# EAGLE design shieldplank (EAGLE 6.2)
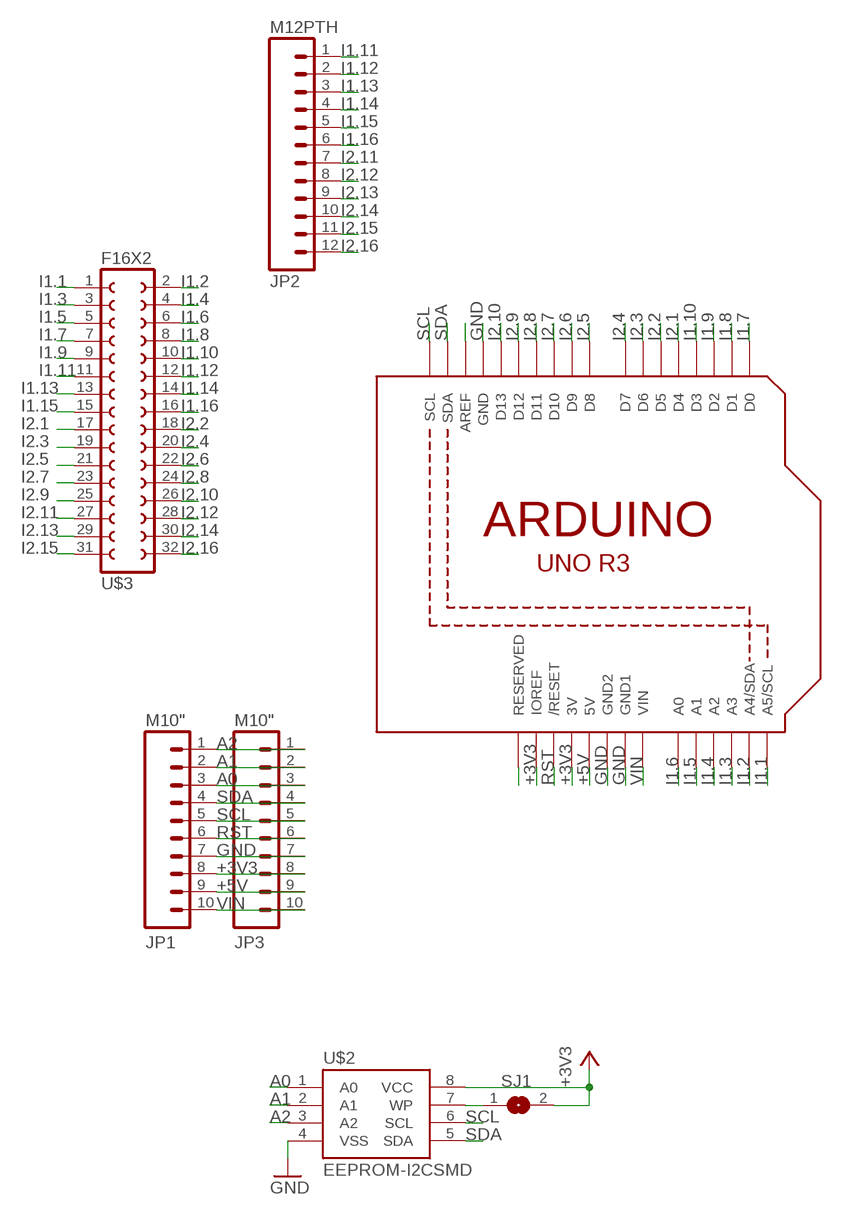
[diagram p0: schematic, sheet 1]

## Parts
JP1  M10"  [1X10]
JP2  M12PTH  [1X12]
JP3  M10"  [1X10]
SJ1  SJ  [SJ]
U1  ARDUINOR3-BPLACE  [ARDUINOR3-BPLACE]
U$2  EEPROM-I2CSMD  [SO08]
U$3  F16X2  [FE16-2]

## Nets
+3V3: JP1.8 JP3.8 SJ1.2 U1.3V U1.IOREF U$2.8(VCC)
+5V: JP1.9 JP3.9 U1.5V
A0: JP1.3 JP3.3 U$2.1(A0)
A1: JP1.2 JP3.2 U$2.2(A1)
A2: JP1.1 JP3.1 U$2.3(A2)
GND: JP1.7 JP3.7 U1.GND U1.GND1 U1.GND2 U$2.4(VSS)
I1.1: U1.A5(A5/SCL) U$3.1
I1.2: U1.A4(A4/SDA) U$3.2
I1.3: U1.A3 U$3.3
I1.4: U1.A2 U$3.4
I1.5: U1.A1 U$3.5
I1.6: U1.A0 U$3.6
I1.7: U1.D0 U$3.7
I1.8: U1.D1 U$3.8
I1.9: U1.D2 U$3.9
I1.10: U1.D3 U$3.10
I1.11: JP2.1 U$3.11
I1.12: JP2.2 U$3.12
I1.13: JP2.3 U$3.13
I1.14: JP2.4 U$3.14
I1.15: JP2.5 U$3.15
I1.16: JP2.6 U$3.16
I2.1: U1.D4 U$3.17
I2.2: U1.D5 U$3.18
I2.3: U1.D6 U$3.19
I2.4: U1.D7 U$3.20
I2.5: U1.D8 U$3.21
I2.6: U1.D9 U$3.22
I2.7: U1.D10 U$3.23
I2.8: U1.D11 U$3.24
I2.9: U1.D12 U$3.25
I2.10: U1.D13 U$3.26
I2.11: JP2.7 U$3.27
I2.12: JP2.8 U$3.28
I2.13: JP2.9 U$3.29
I2.14: JP2.10 U$3.30
I2.15: JP2.11 U$3.31
I2.16: JP2.12 U$3.32
N$1: SJ1.1 U$2.7(WP)
N$4: U1.AREF
N$20: U1.RESERVED
RST: JP1.6 JP3.6 U1.RESET(/RESET)
SCL: JP1.5 JP3.5 U1.SCL U$2.6(SCL)
SDA: JP1.4 JP3.4 U1.SDA U$2.5(SDA)
VIN: JP1.10 JP3.10 U1.VIN

## Library data of the parts
JP1 JP3 = SparkFun-Connectors:M10: Header 10 Standard 10-pin 0.1" header. Use with straight break away headers (SKU : PRT-00116), right angle break away headers (PRT-00553), swiss pins (PRT-00743), machine pins (PRT-00117), and female headers (PRT-00115).
JP2 = SparkFun-Connectors:M12: Header 12 Standard 12-pin 0.1" header. Use with straight break away headers (SKU : PRT-00116), right angle break away headers (PRT-00553), swiss pins (PRT-00743), machine pins (PRT-00117), and female headers (PRT-00115).
SJ1 = jumper:SJ: SMD solder JUMPER
U1 = adafruit:ARDUINOR3: This is a new object for the new Arduino R3 - with extra pins that you may want to use (such as IOref, and duplicated A4/A5
U$2 = SparkFun-DigitalIC:EEPROM-I2C: I2C EEPROM chips, 24LC256 (and others)
U$3 = nickparts:F16X2

## Board
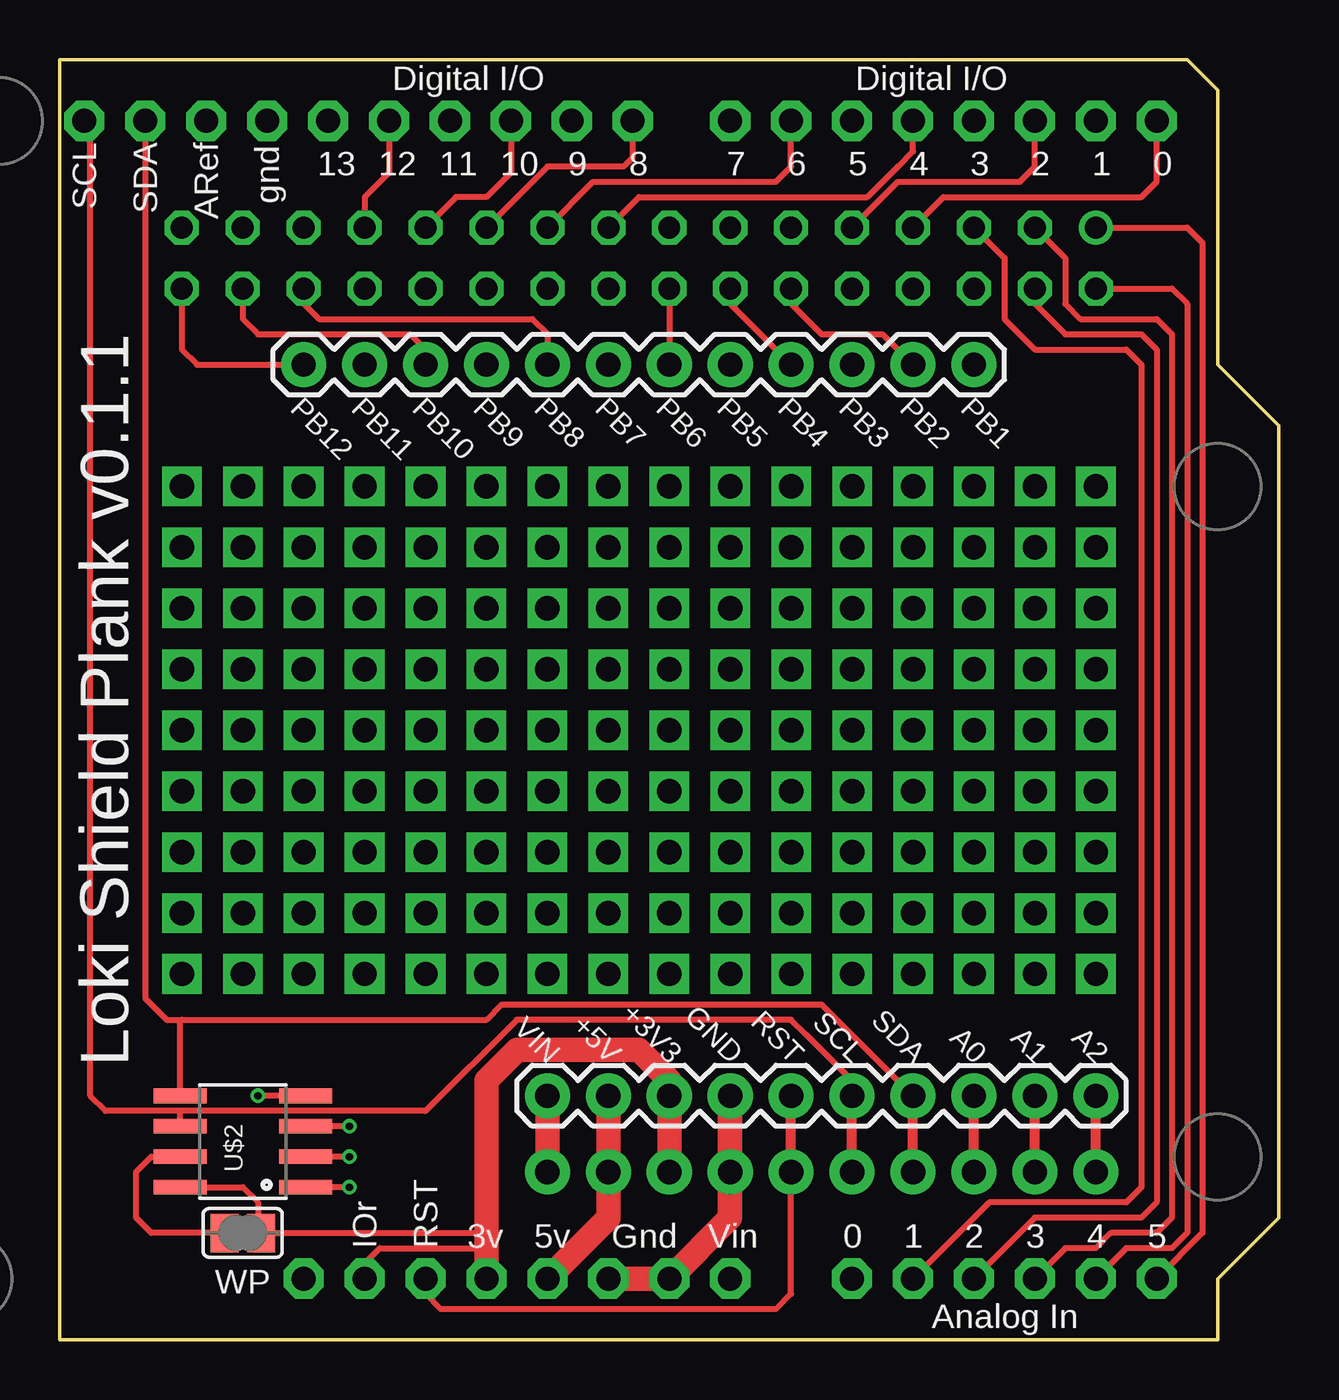
[diagram p1: board, top side]
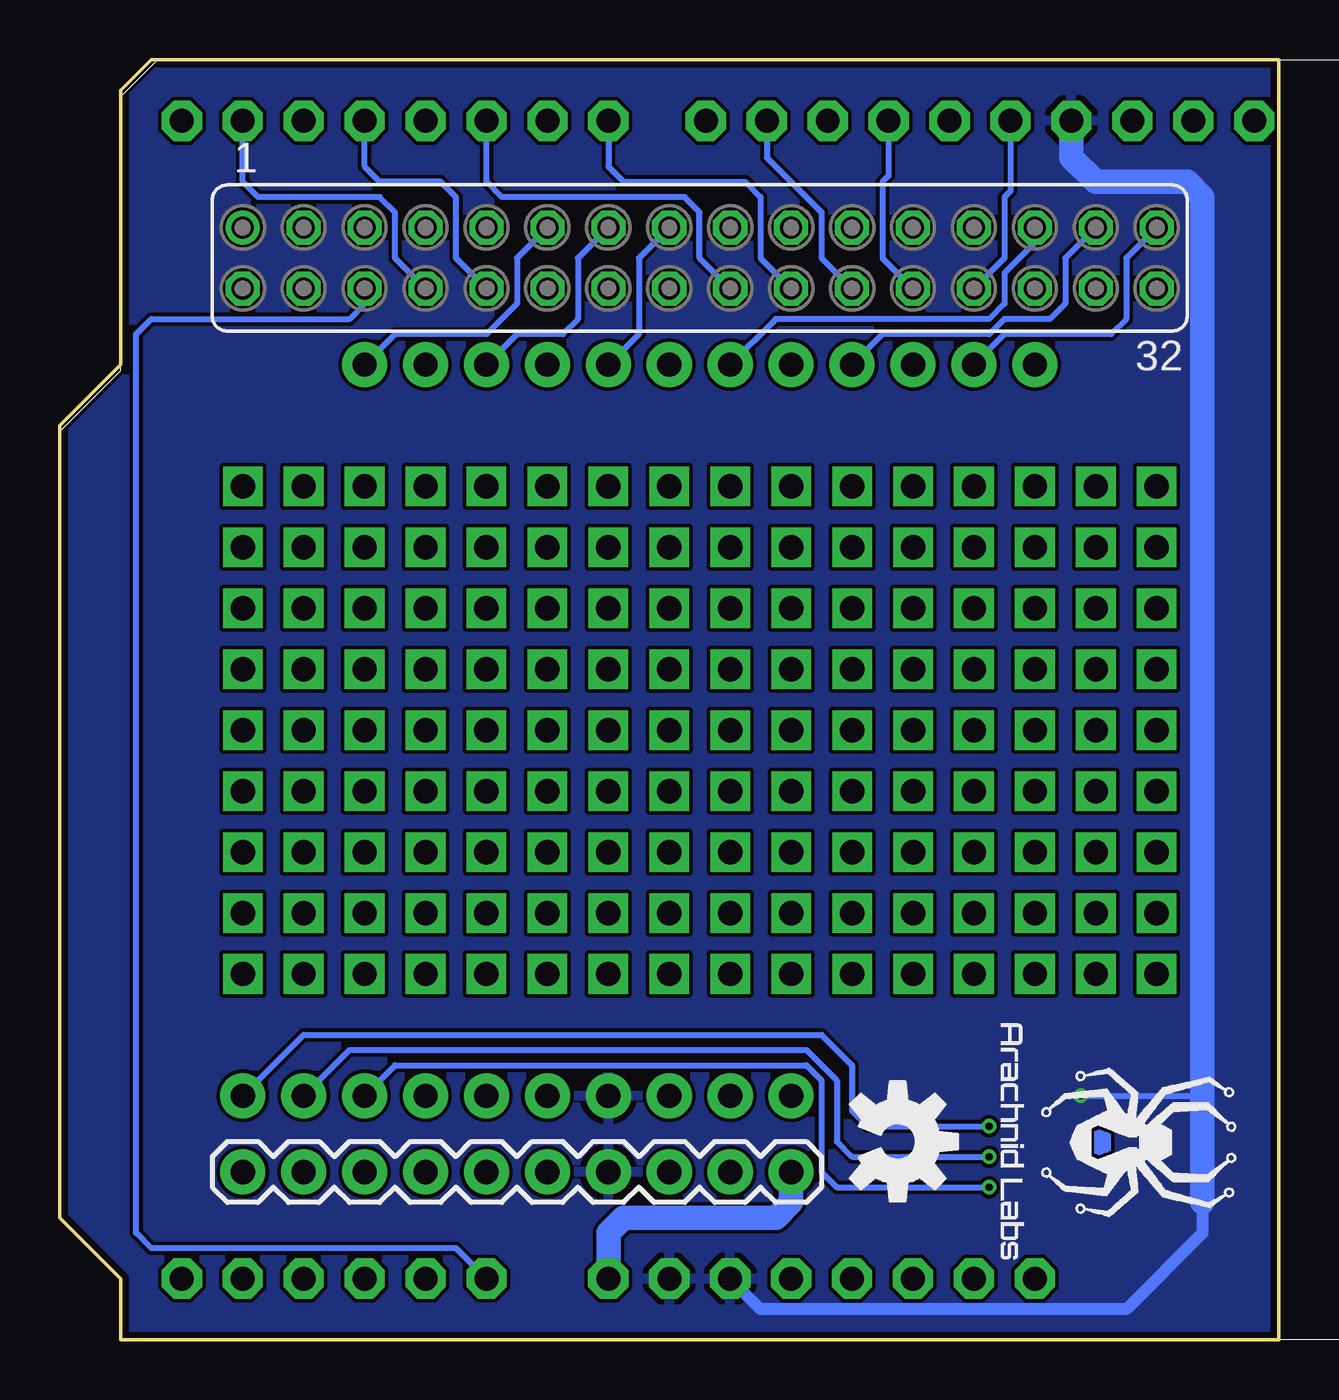
[diagram p2: board, bottom side, seen from below]

Size 50.8 x 53.34 mm. Coordinates in mm from the lower left corner, seen from the top.
Outline: 0,0 0,53.34 46.99,53.34 48.26,52.07 48.26,40.64 50.8,38.1 50.8,5.08 48.26,2.54 48.26,0 0,0
Copper layers (1*16): Top 0.035mm / dielectric 1.5mm / Bottom 0.035mm
Design rules: minimum track width 6mil, minimum drill 0.3mm, track to track 6mil, track to pad 6mil, pad to pad 6mil, via to via 6mil, smd to smd 0mil, copper to edge 10mil, drill to drill 10mil, minimum pad ring 10mil, minimum via ring 6mil, stop-mask expansion 2mil, vias tented up to drill 100mil, thermal gap 10mil

### Footprints (pad centres in the part's own frame; a part is rotated, then mirrored left to right if it is on the bottom)
1X10 = drill 1.016 pad 1.88: 1 0,0; 2 2.54,0; 3 5.08,0; 4 7.62,0; 5 10.16,0; 6 12.7,0; 7 15.24,0; 8 17.78,0; 9 20.32,0; 10 22.86,0
1X12 = drill 1.016 pad 1.88: 1 0,0; 2 2.54,0; 3 5.08,0; 4 7.62,0; 5 10.16,0; 6 12.7,0; 7 15.24,0; 8 17.78,0; 9 20.32,0; 10 22.86,0; 11 25.4,0; 12 27.94,0
SJ = smd 1.168 x 1.6: 1 -0.762,0; 2 0.762,0
ARDUINOR3-BPLACE = drill 1 pad 1.676 octagon: 3V 35.56,2.54; 5V 38.1,2.54; A0 50.8,2.54; A1 53.34,2.54; A2 55.88,2.54; A3 58.42,2.54; A4 60.96,2.54; A5 63.5,2.54; AREF 23.876,50.8; D0 63.5,50.8; D1 60.96,50.8; D2 58.42,50.8; D3 55.88,50.8; D4 53.34,50.8; D5 50.8,50.8; D6 48.26,50.8; D7 45.72,50.8; D8 41.656,50.8; D9 39.116,50.8; D10 36.576,50.8; D11 34.036,50.8; D12 31.496,50.8; D13 28.956,50.8; GND 26.416,50.8; GND1 43.18,2.54; GND2 40.64,2.54; IOREF 30.48,2.54; RESERVED 27.94,2.54; RESET 33.02,2.54; SCL 18.796,50.8; SDA 21.336,50.8; VIN 45.72,2.54
SO08 = smd 0.61 x 2.21: 1 -1.905,-2.616; 2 -0.635,-2.616; 3 0.635,-2.616; 4 1.905,-2.616; 5 1.905,2.616; 6 0.635,2.616; 7 -0.635,2.616; 8 -1.905,2.616
FE16-2 = drill 0.914: 1 1.27,3.81 | drill 0.914 octagon: 2 1.27,1.27; 3 3.81,3.81; 4 3.81,1.27; 5 6.35,3.81; 6 6.35,1.27; 7 8.89,3.81; 8 8.89,1.27; 9 11.43,3.81; 10 11.43,1.27; 11 13.97,3.81; 12 13.97,1.27; 13 16.51,3.81; 14 16.51,1.27; 15 19.05,3.81; 16 19.05,1.27; 17 21.59,3.81; 18 21.59,1.27; 19 24.13,3.81; 20 24.13,1.27; 21 26.67,3.81; 22 26.67,1.27; 23 29.21,3.81; 24 29.21,1.27; 25 31.75,3.81; 26 31.75,1.27; 27 34.29,3.81; 28 34.29,1.27; 29 36.83,3.81; 30 36.83,1.27; 31 39.37,3.81; 32 39.37,1.27

### Placement (x,y rotation side)
JP1  43.18,6.99 0 bottom
JP2  38.1,40.64 180 top
JP3  43.18,10.16 180 top
SJ1  7.62,4.45 0 top
U1  -17.78,0 0 top
U$1  [ARACHNID_LABS_LOGO_SM]  6.67,8.26 270 bottom
U$2  7.62,8.26 90 top
U$3  44.45,42.55 0 bottom
U$4  [OSHW-LOGO-M]  15.88,8.26 270 bottom

### Tracks (layer width: path | path; a pad name or v marks a point on that pad's centre or on a via)
+3V3
  Top 0.254: U1.IOREF 12.7,3.17 13.34,3.81 17.78,3.81 | U$2.8 7.62,6.35 8.26,5.71 8.26,4.57 SJ1.2 17.78,4.45
  Top 1.016: U1.3V 17.78,3.81 17.78,4.45 17.78,10.79 19.05,12.06 24.13,12.06 25.4,10.79 JP3.8 JP1.8
+5V
  Top 1.016: U1.5V 22.86,5.08 JP1.9 JP3.9
A0  (via drill 0.3)
  Top 0.254: v12.06,6.35 U$2.1
  Top 0.406: JP1.3 JP3.3
  Bottom 0.254: JP3.3 36.83,11.43 19.68,11.43 19.05,10.79 19.05,6.99 18.41,6.35 v12.06,6.35
A1  (via drill 0.3)
  Top 0.254: v12.06,7.62 U$2.2
  Top 0.406: JP1.2 JP3.2
  Bottom 0.254: JP3.2 38.73,12.06 19.68,12.06 18.41,10.79 18.41,8.26 17.78,7.62 v12.06,7.62
A2  (via drill 0.3)
  Top 0.254: v12.06,8.89 U$2.3
  Top 0.406: JP1.1 JP3.1
  Bottom 0.254: JP3.1 40.64,12.7 19.05,12.7 17.78,11.43 17.78,9.53 17.14,8.89 v12.06,8.89
GND  (via drill 0.3)
  Top 0.254: U$2.4 v8.26,10.16
  Top 1.016: U1.GND2 U1.GND1 27.94,5.08 JP1.7 JP3.7
  Bottom 0.254: v8.26,10.16 3.17,10.16
  Bottom 0.508: 3.17,5.71 3.17,4.45 6.35,1.27 21.59,1.27 U1.GND2
  Bottom 1.016: U1.GND 8.64,49.28 7.62,48.26 3.81,48.26 3.17,47.62 3.17,10.16 3.17,8.89 3.17,5.71
  pour Bottom: 0,53.34 50.8,53.34 50.8,0 0,0
I1.1
  Top 0.254: U$3.1 46.99,46.35 47.62,45.72 47.62,4.45 U1.A5
I1.2
  Top 0.254: U$3.2 46.35,43.81 46.99,43.18 46.99,4.45 46.35,3.81 44.45,3.81 U1.A4
I1.3
  Top 0.254: U$3.3 41.91,45.09 41.91,43.18 42.55,42.55 45.72,42.55 46.35,41.91 46.35,5.08 45.72,4.45 43.81,4.45 43.18,3.81 41.91,3.81 U1.A3
I1.4
  Top 0.254: U$3.4 40.64,43.18 41.91,41.91 45.09,41.91 45.72,41.27 45.72,5.71 45.09,5.08 40.64,5.08 U1.A2
I1.5
  Top 0.254: U$3.5 39.37,45.09 39.37,42.55 40.64,41.27 44.45,41.27 45.09,40.64 45.09,6.35 44.45,5.71 38.73,5.71 U1.A1
I1.6
  Bottom 0.254: U1.A0 34.29,3.81 46.99,3.81 47.62,4.45 47.62,41.91 46.99,42.55 38.73,42.55 38.1,43.18 U$3.6
I1.7
  Top 0.254: U$3.7 36.83,47.62 45.09,47.62 45.72,48.26 U1.D0
I1.8
  Bottom 0.254: U$3.8 36.83,45.09 36.83,46.99 37.47,47.62 42.55,47.62 43.18,48.26 U1.D1
I1.9
  Top 0.254: U$3.9 34.92,48.26 40.01,48.26 40.64,48.9 U1.D2
I1.10
  Bottom 0.254: U$3.10 34.29,45.09 34.29,47.62 34.92,48.26 37.47,48.26 38.1,48.9 U1.D3
I1.11
  Bottom 0.254: U$3.11 31.75,45.09 31.75,43.18 33.02,41.91 36.83,41.91 JP2.1
I1.12
  Top 0.254: U$3.12 30.48,43.18 31.75,41.91 34.29,41.91 JP2.2
I1.13
  Bottom 0.254: U$3.13 29.21,45.09 29.21,42.55 29.84,41.91 31.75,41.91 JP2.3
I1.14
  Top 0.254: U$3.14 27.94,43.18 JP2.4
I1.15
  Bottom 0.254: U$3.15 26.67,45.09 26.67,41.91 JP2.5
I1.16
  Top 0.254: U$3.16 JP2.6
I2.1
  Top 0.254: U$3.17 24.13,47.62 33.66,47.62 34.92,48.9 35.56,49.53 U1.D4
I2.2
  Bottom 0.254: U$3.18 24.13,45.09 24.13,46.99 24.77,47.62 32.38,47.62 33.02,48.26 U1.D5
I2.3
  Top 0.254: U$3.19 22.23,48.26 29.84,48.26 30.48,48.9 U1.D6
I2.4
  Bottom 0.254: U1.D7 27.94,48.9 27.3,48.26 22.23,48.26 21.59,47.62 21.59,45.09 U$3.20
I2.5
  Top 0.254: U$3.21 20.32,48.9 23.5,48.9 23.88,49.28 U1.D8
I2.6
  Bottom 0.254: U1.D9 21.34,49.28 19.05,46.99 19.05,45.09 U$3.22
I2.7
  Top 0.254: U1.D10 18.8,48.64 17.78,47.62 16.51,47.62 U$3.23
I2.8
  Bottom 0.254: U1.D11 16.26,48.51 16.51,48.26 16.51,45.09 U$3.24
I2.9
  Top 0.254: U1.D12 13.72,48.64 12.7,47.62 U$3.25
I2.10
  Bottom 0.254: U$3.26 11.43,45.09 11.43,47.62 11.18,47.88 U1.D13
I2.11
  Bottom 0.254: U$3.27 10.16,45.72 11.43,44.45 11.43,43.18 12.06,42.55 20.95,42.55 JP2.7
I2.12
  Top 0.254: U$3.28 10.16,43.18 10.79,42.55 19.68,42.55 20.32,41.91 JP2.8
I2.13
  Bottom 0.254: U$3.29 8.89,45.09 8.89,43.18 9.53,42.55 11.43,42.55 12.06,41.91 16.51,41.91 JP2.9
I2.14
  Top 0.254: U$3.30 7.62,42.55 8.26,41.91 14.61,41.91 15.24,41.27 JP2.10
I2.15
  Bottom 0.254: U$3.31 6.35,45.09 6.35,42.55 6.99,41.91 11.43,41.91 JP2.11
I2.16
  Top 0.254: U$3.32 5.08,41.27 5.71,40.64 JP2.12
N$1
  Top 0.254: SJ1.1 3.81,4.45 3.17,5.08 3.17,6.99 3.81,7.62 U$2.7
N$19  (via drill 1.02 pad 1.65)
  other vias: 5.08,35.56
N$21  (via drill 1.02 pad 1.65)
  other vias: 7.62,35.56
N$22  (via drill 1.02 pad 1.65)
  other vias: 10.16,35.56
N$23  (via drill 1.02 pad 1.65)
  other vias: 12.7,35.56
N$24  (via drill 1.02 pad 1.65)
  other vias: 15.24,35.56
N$25  (via drill 1.02 pad 1.65)
  other vias: 17.78,35.56
N$26  (via drill 1.02 pad 1.65)
  other vias: 20.32,35.56
N$27  (via drill 1.02 pad 1.65)
  other vias: 22.86,35.56
N$28  (via drill 1.02 pad 1.65)
  other vias: 25.4,35.56
N$29  (via drill 1.02 pad 1.65)
  other vias: 27.94,35.56
N$30  (via drill 1.02 pad 1.65)
  other vias: 30.48,35.56
N$31  (via drill 1.02 pad 1.65)
  other vias: 33.02,35.56
N$32  (via drill 1.02 pad 1.65)
  other vias: 35.56,35.56
N$33  (via drill 1.02 pad 1.65)
  other vias: 38.1,35.56
N$34  (via drill 1.02 pad 1.65)
  other vias: 40.64,35.56
N$35  (via drill 1.02 pad 1.65)
  other vias: 43.18,35.56
N$36  (via drill 1.02 pad 1.65)
  other vias: 5.08,33.02
N$37  (via drill 1.02 pad 1.65)
  other vias: 7.62,33.02
N$38  (via drill 1.02 pad 1.65)
  other vias: 10.16,33.02
N$39  (via drill 1.02 pad 1.65)
  other vias: 12.7,33.02
N$40  (via drill 1.02 pad 1.65)
  other vias: 15.24,33.02
N$41  (via drill 1.02 pad 1.65)
  other vias: 17.78,33.02
N$42  (via drill 1.02 pad 1.65)
  other vias: 20.32,33.02
N$43  (via drill 1.02 pad 1.65)
  other vias: 22.86,33.02
N$44  (via drill 1.02 pad 1.65)
  other vias: 25.4,33.02
N$45  (via drill 1.02 pad 1.65)
  other vias: 27.94,33.02
N$46  (via drill 1.02 pad 1.65)
  other vias: 30.48,33.02
N$47  (via drill 1.02 pad 1.65)
  other vias: 33.02,33.02
N$48  (via drill 1.02 pad 1.65)
  other vias: 35.56,33.02
N$49  (via drill 1.02 pad 1.65)
  other vias: 38.1,33.02
N$50  (via drill 1.02 pad 1.65)
  other vias: 40.64,33.02
N$51  (via drill 1.02 pad 1.65)
  other vias: 43.18,33.02
N$52  (via drill 1.02 pad 1.65)
  other vias: 5.08,30.48
N$53  (via drill 1.02 pad 1.65)
  other vias: 7.62,30.48
N$54  (via drill 1.02 pad 1.65)
  other vias: 10.16,30.48
N$55  (via drill 1.02 pad 1.65)
  other vias: 12.7,30.48
N$56  (via drill 1.02 pad 1.65)
  other vias: 15.24,30.48
N$57  (via drill 1.02 pad 1.65)
  other vias: 17.78,30.48
N$58  (via drill 1.02 pad 1.65)
  other vias: 20.32,30.48
N$59  (via drill 1.02 pad 1.65)
  other vias: 22.86,30.48
N$60  (via drill 1.02 pad 1.65)
  other vias: 25.4,30.48
N$61  (via drill 1.02 pad 1.65)
  other vias: 27.94,30.48
N$62  (via drill 1.02 pad 1.65)
  other vias: 30.48,30.48
N$63  (via drill 1.02 pad 1.65)
  other vias: 33.02,30.48
N$64  (via drill 1.02 pad 1.65)
  other vias: 35.56,30.48
N$65  (via drill 1.02 pad 1.65)
  other vias: 38.1,30.48
N$66  (via drill 1.02 pad 1.65)
  other vias: 40.64,30.48
N$67  (via drill 1.02 pad 1.65)
  other vias: 43.18,30.48
N$68  (via drill 1.02 pad 1.65)
  other vias: 5.08,27.94
N$69  (via drill 1.02 pad 1.65)
  other vias: 7.62,27.94
N$70  (via drill 1.02 pad 1.65)
  other vias: 10.16,27.94
N$71  (via drill 1.02 pad 1.65)
  other vias: 12.7,27.94
N$72  (via drill 1.02 pad 1.65)
  other vias: 15.24,27.94
N$73  (via drill 1.02 pad 1.65)
  other vias: 17.78,27.94
N$74  (via drill 1.02 pad 1.65)
  other vias: 20.32,27.94
N$75  (via drill 1.02 pad 1.65)
  other vias: 22.86,27.94
N$76  (via drill 1.02 pad 1.65)
  other vias: 25.4,27.94
N$77  (via drill 1.02 pad 1.65)
  other vias: 27.94,27.94
N$78  (via drill 1.02 pad 1.65)
  other vias: 30.48,27.94
N$79  (via drill 1.02 pad 1.65)
  other vias: 33.02,27.94
N$80  (via drill 1.02 pad 1.65)
  other vias: 35.56,27.94
N$81  (via drill 1.02 pad 1.65)
  other vias: 38.1,27.94
N$82  (via drill 1.02 pad 1.65)
  other vias: 40.64,27.94
N$83  (via drill 1.02 pad 1.65)
  other vias: 43.18,27.94
N$84  (via drill 1.02 pad 1.65)
  other vias: 5.08,25.4
N$85  (via drill 1.02 pad 1.65)
  other vias: 7.62,25.4
N$86  (via drill 1.02 pad 1.65)
  other vias: 10.16,25.4
N$87  (via drill 1.02 pad 1.65)
  other vias: 12.7,25.4
N$88  (via drill 1.02 pad 1.65)
  other vias: 15.24,25.4
N$89  (via drill 1.02 pad 1.65)
  other vias: 17.78,25.4
N$90  (via drill 1.02 pad 1.65)
  other vias: 20.32,25.4
N$91  (via drill 1.02 pad 1.65)
  other vias: 22.86,25.4
N$92  (via drill 1.02 pad 1.65)
  other vias: 25.4,25.4
N$93  (via drill 1.02 pad 1.65)
  other vias: 27.94,25.4
N$94  (via drill 1.02 pad 1.65)
  other vias: 30.48,25.4
N$95  (via drill 1.02 pad 1.65)
  other vias: 33.02,25.4
N$96  (via drill 1.02 pad 1.65)
  other vias: 35.56,25.4
N$97  (via drill 1.02 pad 1.65)
  other vias: 38.1,25.4
N$98  (via drill 1.02 pad 1.65)
  other vias: 40.64,25.4
N$99  (via drill 1.02 pad 1.65)
  other vias: 43.18,25.4
N$100  (via drill 1.02 pad 1.65)
  other vias: 5.08,22.86
N$101  (via drill 1.02 pad 1.65)
  other vias: 7.62,22.86
N$102  (via drill 1.02 pad 1.65)
  other vias: 10.16,22.86
N$103  (via drill 1.02 pad 1.65)
  other vias: 12.7,22.86
N$104  (via drill 1.02 pad 1.65)
  other vias: 15.24,22.86
N$105  (via drill 1.02 pad 1.65)
  other vias: 17.78,22.86
N$106  (via drill 1.02 pad 1.65)
  other vias: 20.32,22.86
N$107  (via drill 1.02 pad 1.65)
  other vias: 22.86,22.86
N$108  (via drill 1.02 pad 1.65)
  other vias: 25.4,22.86
N$109  (via drill 1.02 pad 1.65)
  other vias: 27.94,22.86
N$110  (via drill 1.02 pad 1.65)
  other vias: 30.48,22.86
N$111  (via drill 1.02 pad 1.65)
  other vias: 33.02,22.86
N$112  (via drill 1.02 pad 1.65)
  other vias: 35.56,22.86
N$113  (via drill 1.02 pad 1.65)
  other vias: 38.1,22.86
N$114  (via drill 1.02 pad 1.65)
  other vias: 40.64,22.86
N$115  (via drill 1.02 pad 1.65)
  other vias: 43.18,22.86
N$116  (via drill 1.02 pad 1.65)
  other vias: 5.08,20.32
N$117  (via drill 1.02 pad 1.65)
  other vias: 7.62,20.32
N$118  (via drill 1.02 pad 1.65)
  other vias: 10.16,20.32
N$119  (via drill 1.02 pad 1.65)
  other vias: 12.7,20.32
N$120  (via drill 1.02 pad 1.65)
  other vias: 15.24,20.32
N$121  (via drill 1.02 pad 1.65)
  other vias: 17.78,20.32
N$122  (via drill 1.02 pad 1.65)
  other vias: 20.32,20.32
N$123  (via drill 1.02 pad 1.65)
  other vias: 22.86,20.32
N$124  (via drill 1.02 pad 1.65)
  other vias: 25.4,20.32
N$125  (via drill 1.02 pad 1.65)
  other vias: 27.94,20.32
N$126  (via drill 1.02 pad 1.65)
  other vias: 30.48,20.32
N$127  (via drill 1.02 pad 1.65)
  other vias: 33.02,20.32
N$128  (via drill 1.02 pad 1.65)
  other vias: 35.56,20.32
N$129  (via drill 1.02 pad 1.65)
  other vias: 38.1,20.32
N$130  (via drill 1.02 pad 1.65)
  other vias: 40.64,20.32
N$131  (via drill 1.02 pad 1.65)
  other vias: 43.18,20.32
N$132  (via drill 1.02 pad 1.65)
  other vias: 5.08,17.78
N$133  (via drill 1.02 pad 1.65)
  other vias: 7.62,17.78
N$134  (via drill 1.02 pad 1.65)
  other vias: 10.16,17.78
N$135  (via drill 1.02 pad 1.65)
  other vias: 12.7,17.78
N$136  (via drill 1.02 pad 1.65)
  other vias: 15.24,17.78
N$137  (via drill 1.02 pad 1.65)
  other vias: 17.78,17.78
N$138  (via drill 1.02 pad 1.65)
  other vias: 20.32,17.78
N$139  (via drill 1.02 pad 1.65)
  other vias: 22.86,17.78
N$140  (via drill 1.02 pad 1.65)
  other vias: 25.4,17.78
N$141  (via drill 1.02 pad 1.65)
  other vias: 27.94,17.78
N$142  (via drill 1.02 pad 1.65)
  other vias: 30.48,17.78
N$143  (via drill 1.02 pad 1.65)
  other vias: 33.02,17.78
N$144  (via drill 1.02 pad 1.65)
  other vias: 35.56,17.78
N$145  (via drill 1.02 pad 1.65)
  other vias: 38.1,17.78
N$146  (via drill 1.02 pad 1.65)
  other vias: 40.64,17.78
N$147  (via drill 1.02 pad 1.65)
  other vias: 43.18,17.78
N$148  (via drill 1.02 pad 1.65)
  other vias: 5.08,15.24
N$149  (via drill 1.02 pad 1.65)
  other vias: 7.62,15.24
N$150  (via drill 1.02 pad 1.65)
  other vias: 10.16,15.24
N$151  (via drill 1.02 pad 1.65)
  other vias: 12.7,15.24
N$152  (via drill 1.02 pad 1.65)
  other vias: 15.24,15.24
N$153  (via drill 1.02 pad 1.65)
  other vias: 17.78,15.24
N$154  (via drill 1.02 pad 1.65)
  other vias: 20.32,15.24
N$155  (via drill 1.02 pad 1.65)
  other vias: 22.86,15.24
N$156  (via drill 1.02 pad 1.65)
  other vias: 25.4,15.24
N$157  (via drill 1.02 pad 1.65)
  other vias: 27.94,15.24
N$158  (via drill 1.02 pad 1.65)
  other vias: 30.48,15.24
N$159  (via drill 1.02 pad 1.65)
  other vias: 33.02,15.24
N$160  (via drill 1.02 pad 1.65)
  other vias: 35.56,15.24
N$161  (via drill 1.02 pad 1.65)
  other vias: 38.1,15.24
N$162  (via drill 1.02 pad 1.65)
  other vias: 40.64,15.24
N$163  (via drill 1.02 pad 1.65)
  other vias: 43.18,15.24
RST
  Top 0.254: U1.RESET 15.24,1.91 15.88,1.27 29.84,1.27 30.48,1.91 JP1.6
  Top 0.406: JP1.6 JP3.6
SCL
  Top 0.254: JP3.5 33.02,10.79 31.11,12.7 30.48,13.34 19.05,13.34 15.24,9.53 5.08,9.53 | 5.08,9.53 1.91,9.53 1.27,10.16 1.27,50.55 U1.SCL | U$2.6 5,9.45 5.08,9.53
  Top 0.406: JP1.5 JP3.5
SDA
  Top 0.254: U1.SDA 3.56,14.22 4.45,13.34 5.08,13.34 | 5.08,13.34 17.78,13.34 18.41,13.97 31.75,13.97 JP3.4 | U$2.5 5,13.26 5.08,13.34
  Top 0.406: JP1.4 JP3.4
VIN
  Top 1.016: JP3.10 JP1.10
  Bottom 1.016: JP1.10 20.32,5.71 20.95,5.08 27.3,5.08 27.94,4.45 U1.VIN

### Text on the board
tNames: PB12 | PB11 | PB10 | PB9 | PB8 | PB7 | PB6 | PB5 | PB4 | PB3 | PB2 | PB1 | Loki Shield Plank v0.1.1 | VIN | +5V | +3V3 | GND | RST | SCL | SDA | A0 | A1 | A2 | WP